# Altium schematic sheet POWER_Control.SchDoc
size A4
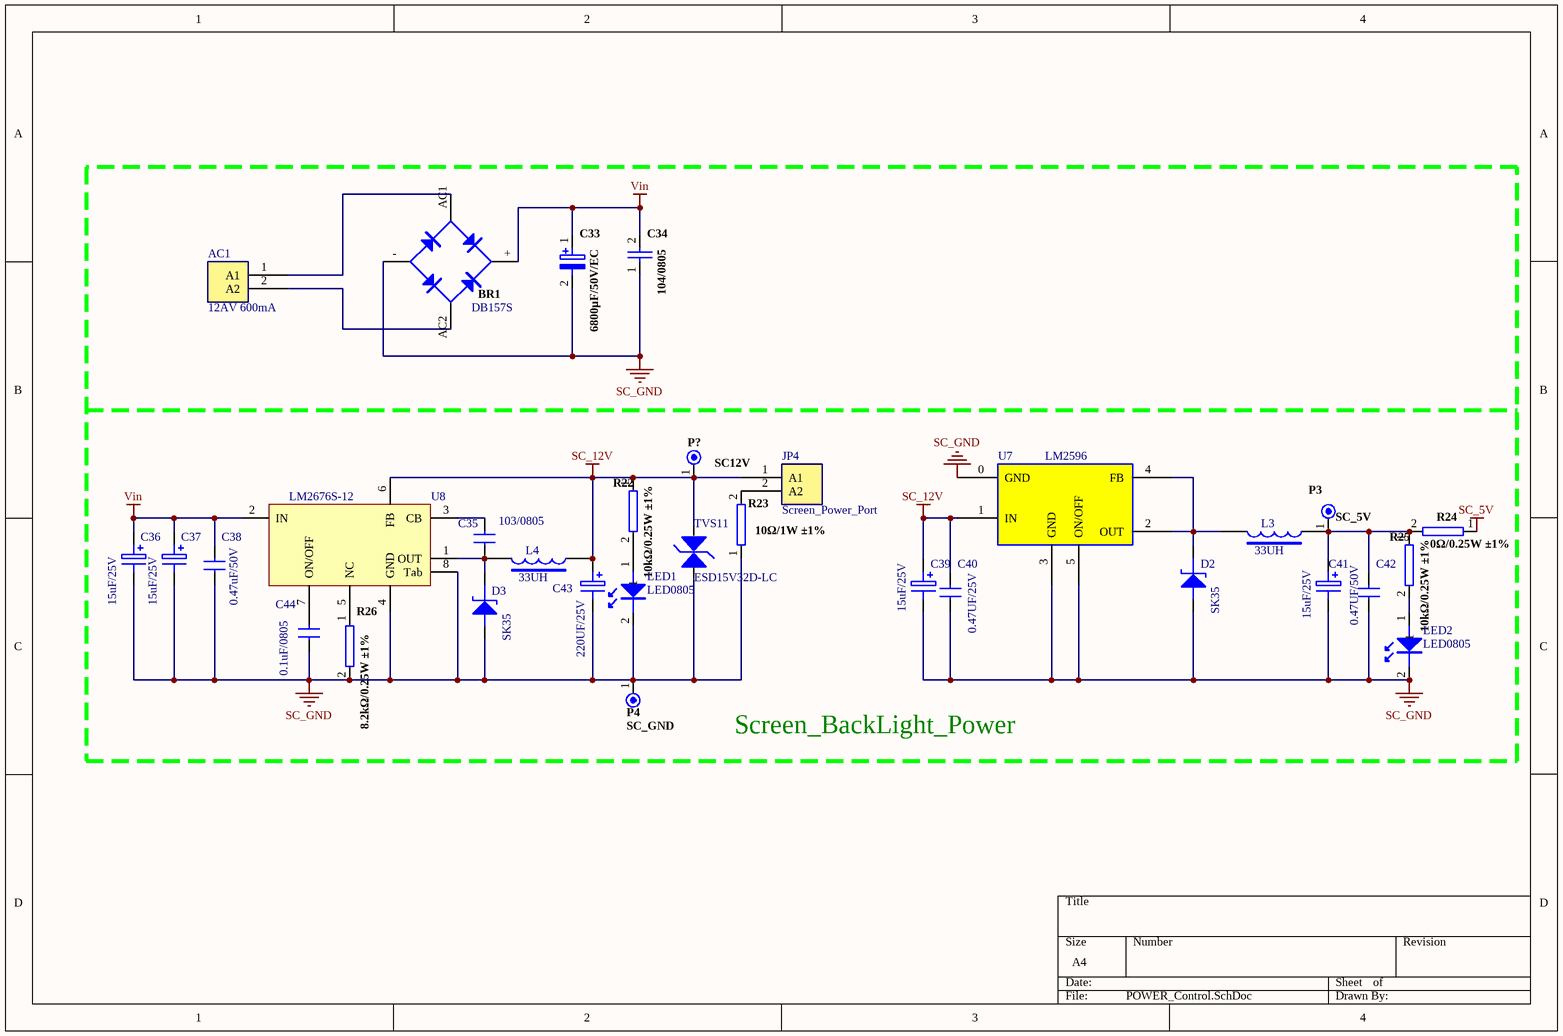
[diagram p0: POWER_Control.SchDoc]

## Parts
AC1  12AV 600mA  [HEADER2]
BR1  DB157S  [DB157S]
C33  6800μF/50V/EC  [RB.4/8]
C34  104/0805  [C0805]
C35  103/0805  [C0805]
C36  15uF/25V  [C6032]
C37  15uF/25V  [C6032]
C38  0.47uF/50V  [C0805]
C39  15uF/25V  [C6032]
C40  value 0.47UF/25V  [C0805]  (hidden comment: 0.47uF/50V)
C41  15uF/25V  [C6032]
C42  0.47uF/50V  [C0805]
C43  220UF/25V  [C10X10]
C44  value 0.1uF/0805  [C0805]  (hidden comment: 0.47UF/50V)
D2  SK35  [SMB-2]
D3  SK35  [SMB-2]
JP4  Screen_Power_Port  [HEADER1X2B]
L3  33UH  [M-SMB7X7]
L4  33UH  [M-SMB7X7]
LED1  LED0805  [LED_0805]
LED2  LED0805  [LED_0805]
P3  SC_5V  [TESTSMD]
P4  SC_GND  [TESTSMD]
P?  SC12V  [TESTSMD]
R22  10kΩ/0.25W ±1%  [R0805]
R23  10Ω/1W ±1%  [R0805]
R24  0Ω/0.25W ±1%  [R0805]
R25  10kΩ/0.25W ±1%  [R0805]
R26  8.2kΩ/0.25W ±1%  [R0805]
TVS11  ESD15V32D-LC  [SOD323]
U7  LM2596  [TO263]
U8  LM2676S-12  [TO-263-7]

## Blocks framed on the sheet
Screen_BackLight_Power: AC1 BR1 C33-C44 D2 D3 JP4 L3 L4 LED1 LED2 P3 P4 P? R22-R26 TVS11 U7 U8

## Nets
SC_5V: R24.1
SC_12V: C39.1 C40.2 C43.1 JP4.1(A1) L4.2 P?.1 R22.1 TVS11.1 U7.1(IN) U8.6(FB)
SC_GND: BR1.-(V-) C33.2 C34.1 C36.2 C37.2 C38.1 C39.2 C40.1 C41.2 C42.1 C43.2 C44.2 D2.1(A) D3.1(A) LED1.2 LED2.2 P4.1 R23.1 R26.2 TVS11.2 U7.0(GND) U7.3(GND) U7.5(ON/OFF) U8.4(GND) U8.8(Tab)
Vin: BR1.+(V+) C33.1 C34.2 C36.1 C37.1 C38.2 U8.2(IN)
NetAC1_1: AC1.1(A1) BR1.AC1
NetAC1_2: AC1.2(A2) BR1.AC2
NetC35_1: C35.1 U8.3(CB)
NetC35_2: C35.2 D3.2(K) L4.1 U8.1(OUT)
NetC41_1: C41.1 C42.2 L3.2 P3.1 R24.2 R25.1
NetC44_1: C44.1 U8.7(ON/OFF)
NetD2_2: D2.2(K) L3.1 U7.2(OUT) U7.4(FB)
NetJP4_2: JP4.2(A2) R23.2
NetLED1_1: LED1.1 R22.2
NetLED2_1: LED2.1 R25.2
NetR26_1: R26.1 U8.5(NC)

## Library data of the parts
AC1 = CON2: 接线端子 AWG14-22 300VAC 16A 5.0mm HEADER2
BR1 = NBRIDGE1: 贴片整流桥 DB157S 50A/1000V
C33 = ELECTRO2: 电解电容 6800μF/50V/EC ±5% RB.3/.6
C34 = CAP: 贴片电容 104/25V ±1% C0805
C35 = CAP: 贴片电容 103/25V ±1% C0805; Value: 103/0805
C36 C37 = ELECTRO1: 贴片钽电容 15uF/25V ±10% C6032; Comme: 15uF/25V/钽电容
C38 C40 C42 = CAP: 贴片电容 0.47uF/50V ±1% C0805
  C38 C42: Value: 0.47UF/50V
C39 C41 = ELECTRO1: 贴片钽电容 15uF/25V ±10% C6032
C43 = ELECTRO1: 贴片钽电容 220uF/25V ±10% C10X10
C44 = CAP: 贴片电容 0.47uF/25V ±1% C0805
D2 D3 = ZENER2: 稳压二极管 SK35 50V 3.0A SMB-2
JP4 = CON2: 连接器 WAFER 2PIN/3.96/自锁 HEADER1X2B
L3 L4 = INDUCTOR2: 贴片电感 33uH 1/4W ±10% M-SMB7X7
LED1 LED2 = LED0805: 贴片LED灯 蓝色 2.0V 20mA LED_0805
P3 P4 P? = CON1
R22 R25 = RES2: 贴片电阻 10kΩ 0.25W ±1% R0805; Part Field 1: 06-115611-18; Par: 电阻
R23 = RES2: 贴片电阻 10Ω/1W ±1% R0805
R24 = RES2: 贴片电阻 0Ω 0.25W ±1% R0805
R26 = RES2: 贴片电阻 8.2kΩ 0.25W ±1% R0805; Part Field 1: 06-115611-18; Par: 电阻
TVS11 = TVS: ESD静电二极管 ESD15V32D-LC 8V 15KV 40A SOD323
U7 = LM2596: 5VDC-DC开关电源IC LM2596 TO263
U8 = LM2676: 12DC-DC开关电源IC LM2676S-12 TO-263-7